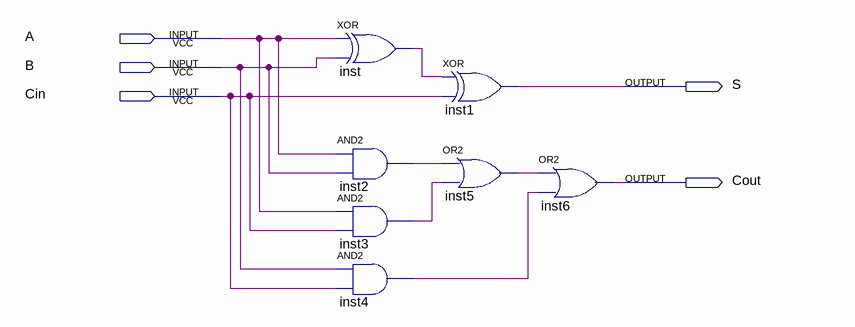
[diagram p0: schematic sheet]
// Quartus schematic lab1_BF.bdf as structural Verilog: 7 symbols, 5 pins
module lab1_BF (
  input  A,
  input  B,
  input  Cin,
  output S,
  output Cout
);

  wire inst2_out, inst3_out, inst4_out, inst5_out, inst_out;

  xor inst (inst_out, A, B);
  and inst2 (inst2_out, A, B);
  and inst3 (inst3_out, A, Cin);
  and inst4 (inst4_out, B, Cin);
  xor inst1 (S, inst_out, Cin);
  or inst5 (inst5_out, inst2_out, inst3_out);
  or inst6 (Cout, inst5_out, inst4_out);
endmodule
